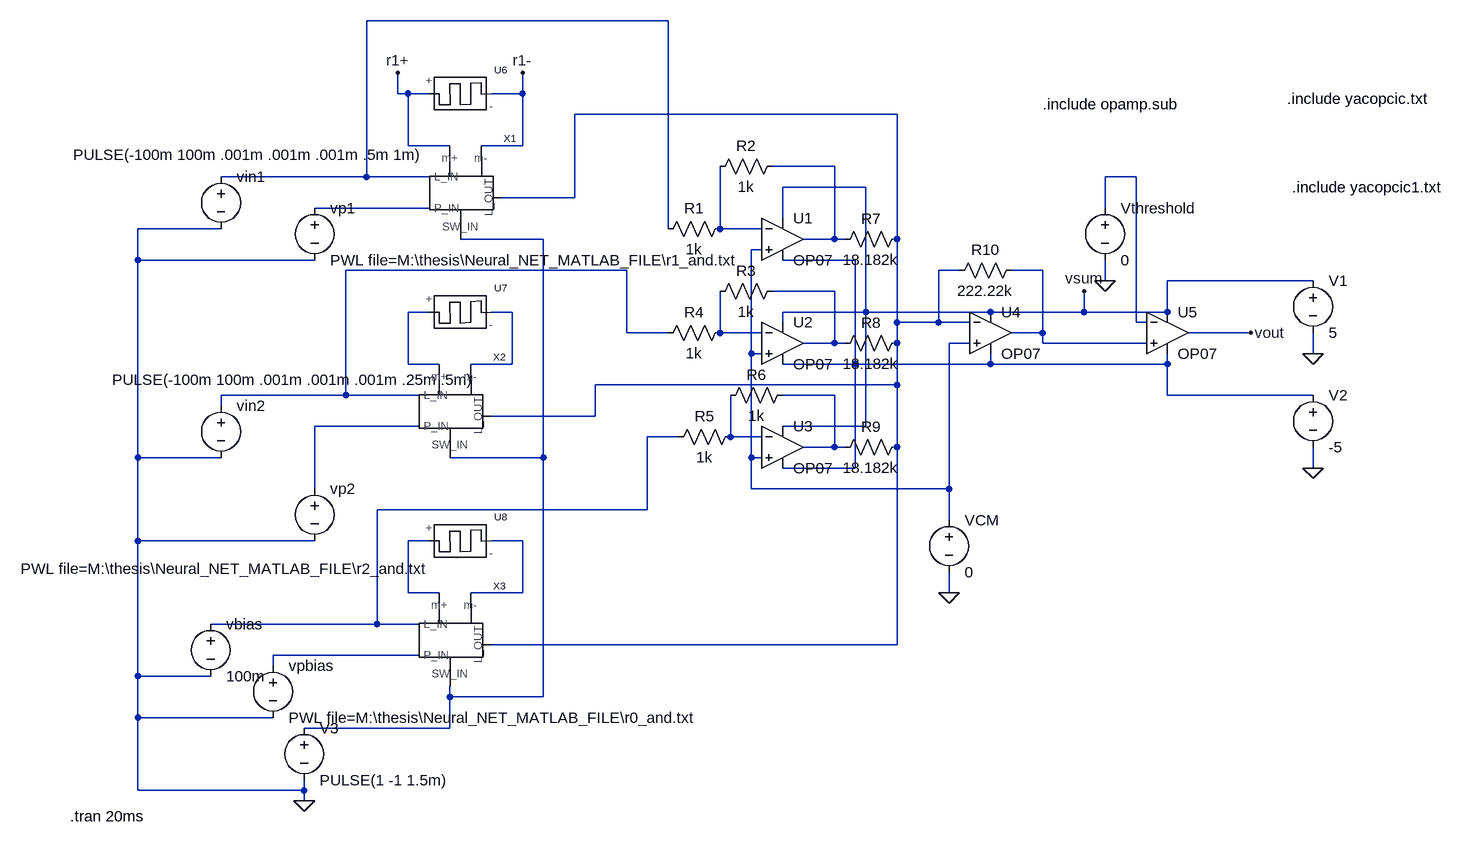
[diagram p0: schematic ADALINECHECK.asc]
ADALINECHECK.asc, the LTspice schematic file:
Version 4
SHEET 1 1164 968
WIRE -80 -272 -544 -272
WIRE -496 -160 -496 -192
WIRE -480 -160 -496 -160
WIRE -448 -160 -480 -160
WIRE -304 -160 -304 -192
WIRE -304 -160 -352 -160
WIRE 272 -128 -224 -128
WIRE -480 -80 -480 -160
WIRE -416 -80 -480 -80
WIRE -304 -80 -304 -160
WIRE -304 -80 -368 -80
WIRE 176 -48 80 -48
WIRE -544 -32 -544 -272
WIRE -544 -32 -768 -32
WIRE -448 -32 -544 -32
WIRE 640 -32 592 -32
WIRE 224 -16 96 -16
WIRE -224 0 -224 -128
WIRE -224 0 -336 0
WIRE -448 16 -624 16
WIRE 592 16 592 -32
WIRE 96 32 96 -16
WIRE -768 48 -896 48
WIRE -80 48 -80 -272
WIRE 0 48 0 -48
WIRE 64 48 0 48
WIRE -272 64 -400 64
WIRE 176 64 176 -48
WIRE 176 64 128 64
WIRE 192 64 176 64
WIRE 272 64 272 -128
WIRE 64 80 48 80
WIRE -896 96 -896 48
WIRE -624 96 -896 96
WIRE 208 96 96 96
WIRE -144 112 -576 112
WIRE 368 112 336 112
WIRE 496 112 448 112
WIRE 592 128 592 96
WIRE 912 128 688 128
WIRE 176 144 80 144
WIRE -448 176 -480 176
WIRE -320 176 -352 176
WIRE 224 176 224 -16
WIRE 224 176 96 176
WIRE 416 176 224 176
WIRE 560 176 560 144
WIRE 560 176 416 176
WIRE 688 176 688 128
WIRE 688 176 560 176
WIRE 96 192 96 176
WIRE 272 192 272 64
WIRE 336 192 336 112
WIRE 336 192 272 192
WIRE 384 192 336 192
WIRE 640 192 640 -32
WIRE 656 192 640 192
WIRE -144 208 -144 112
WIRE -80 208 -144 208
WIRE 0 208 0 144
WIRE 64 208 0 208
WIRE 496 208 496 112
WIRE 496 208 448 208
WIRE 816 208 720 208
WIRE 176 224 176 144
WIRE 176 224 128 224
WIRE 192 224 176 224
WIRE 272 224 272 192
WIRE 384 224 352 224
WIRE 496 224 496 208
WIRE 656 224 496 224
WIRE 48 240 48 80
WIRE 64 240 48 240
WIRE 912 240 912 208
WIRE -480 256 -480 176
WIRE -432 256 -480 256
WIRE -320 256 -320 176
WIRE -320 256 -384 256
WIRE 208 256 208 96
WIRE 208 256 96 256
WIRE 416 256 416 240
WIRE 416 256 208 256
WIRE 688 256 688 240
WIRE 688 256 416 256
WIRE 272 288 272 224
WIRE 272 288 -192 288
WIRE -576 304 -576 112
WIRE -576 304 -768 304
WIRE -464 304 -576 304
WIRE 176 304 96 304
WIRE 688 304 688 256
WIRE 912 304 688 304
WIRE -768 320 -768 304
WIRE -192 336 -192 288
WIRE -192 336 -352 336
WIRE -464 352 -624 352
WIRE 224 352 224 176
WIRE 224 352 96 352
WIRE -64 368 -112 368
WIRE 16 368 16 304
WIRE 64 368 16 368
WIRE 176 384 176 304
WIRE 176 384 128 384
WIRE 192 384 176 384
WIRE 272 384 272 288
WIRE -896 400 -896 96
WIRE -768 400 -896 400
WIRE -272 400 -272 64
WIRE -272 400 -416 400
WIRE 48 400 48 240
WIRE 64 400 48 400
WIRE 208 416 208 256
WIRE 208 416 96 416
WIRE 912 416 912 384
WIRE -624 448 -624 352
WIRE 48 448 48 400
WIRE 352 448 352 224
WIRE 352 448 48 448
WIRE -112 480 -112 368
WIRE -112 480 -528 480
WIRE 352 496 352 448
WIRE -896 528 -896 400
WIRE -624 528 -896 528
WIRE -448 528 -480 528
WIRE -304 528 -352 528
WIRE -480 608 -480 528
WIRE -432 608 -480 608
WIRE -304 608 -304 528
WIRE -304 608 -384 608
WIRE 352 608 352 576
WIRE -528 656 -528 480
WIRE -528 656 -784 656
WIRE -464 656 -528 656
WIRE 272 688 272 384
WIRE 272 688 -352 688
WIRE -464 704 -688 704
WIRE -688 720 -688 704
WIRE -896 736 -896 528
WIRE -784 736 -896 736
WIRE -416 768 -416 752
WIRE -272 768 -272 400
WIRE -272 768 -416 768
WIRE -896 800 -896 736
WIRE -688 800 -896 800
WIRE -416 816 -416 768
WIRE -416 816 -640 816
WIRE -896 912 -896 800
WIRE -640 912 -640 896
WIRE -640 912 -896 912
WIRE -640 928 -640 912
FLAG 912 416 0
FLAG 912 240 0
FLAG 352 608 0
FLAG -640 928 0
FLAG 816 208 vout
FLAG 560 144 vsum
FLAG 592 128 0
FLAG -496 -192 r1+
FLAG -304 -192 r1-
SYMBOL Opamps\\OP07 96 0 R0
SYMATTR InstName U1
SYMBOL Opamps\\OP07 96 160 R0
SYMATTR InstName U2
SYMBOL Opamps\\OP07 96 320 R0
SYMATTR InstName U3
SYMBOL Opamps\\OP07 416 144 R0
SYMATTR InstName U4
SYMBOL Opamps\\OP07 688 144 R0
SYMATTR InstName U5
SYMBOL res 16 32 R90
WINDOW 0 0 56 VBottom 2
WINDOW 3 32 56 VTop 2
SYMATTR InstName R1
SYMATTR Value 1k
SYMBOL res 96 -64 R90
WINDOW 0 0 56 VBottom 2
WINDOW 3 32 56 VTop 2
SYMATTR InstName R2
SYMATTR Value 1k
SYMBOL res 96 128 R90
WINDOW 0 0 56 VBottom 2
WINDOW 3 32 56 VTop 2
SYMATTR InstName R3
SYMATTR Value 1k
SYMBOL res 16 192 R90
WINDOW 0 0 56 VBottom 2
WINDOW 3 32 56 VTop 2
SYMATTR InstName R4
SYMATTR Value 1k
SYMBOL res 32 352 R90
WINDOW 0 0 56 VBottom 2
WINDOW 3 32 56 VTop 2
SYMATTR InstName R5
SYMATTR Value 1k
SYMBOL res 112 288 R90
WINDOW 0 0 56 VBottom 2
WINDOW 3 32 56 VTop 2
SYMATTR InstName R6
SYMATTR Value 1k
SYMBOL res 288 48 R90
WINDOW 0 0 56 VBottom 2
WINDOW 3 32 56 VTop 2
SYMATTR InstName R7
SYMATTR Value 18.182k
SYMBOL res 288 208 R90
WINDOW 0 0 56 VBottom 2
WINDOW 3 32 56 VTop 2
SYMATTR InstName R8
SYMATTR Value 18.182k
SYMBOL res 288 368 R90
WINDOW 0 0 56 VBottom 2
WINDOW 3 32 56 VTop 2
SYMATTR InstName R9
SYMATTR Value 18.182k
SYMBOL res 464 96 R90
WINDOW 0 0 56 VBottom 2
WINDOW 3 32 56 VTop 2
SYMATTR InstName R10
SYMATTR Value 222.22k
SYMBOL memristormodel -368 -160 R0
SYMATTR InstName U6
SYMATTR Value MEM_YAKOPCIC1
SYMATTR SpiceModel M1
SYMBOL memristormodel -368 176 R0
SYMATTR InstName U7
SYMATTR Value MEM_YAKOPCIC
SYMATTR SpiceModel M2
SYMBOL memristormodel -368 528 R0
SYMATTR InstName U8
SYMATTR Value MEM_YAKOPCIC
SYMATTR SpiceModel M0
SYMBOL voltage 912 112 R0
WINDOW 123 0 0 Left 2
WINDOW 39 0 0 Left 2
SYMATTR InstName V1
SYMATTR Value 5
SYMBOL voltage 912 288 R0
WINDOW 123 0 0 Left 2
WINDOW 39 0 0 Left 2
SYMATTR InstName V2
SYMATTR Value -5
SYMBOL voltage -640 800 R0
WINDOW 123 0 0 Left 2
WINDOW 39 0 0 Left 2
SYMATTR InstName V3
SYMATTR Value PULSE(1 -1 1.5m)
SYMBOL voltage -624 432 R0
WINDOW 123 0 0 Left 2
WINDOW 39 0 0 Left 2
WINDOW 3 -452 139 Left 2
SYMATTR InstName vp2
SYMATTR Value PWL file=M:\thesis\Neural_NET_MATLAB_FILE\r2_and.txt
SYMBOL voltage -768 304 R0
WINDOW 3 -167 -24 Left 2
WINDOW 123 0 0 Left 2
WINDOW 39 0 0 Left 2
SYMATTR Value PULSE(-100m 100m .001m .001m .001m .25m .5m)
SYMATTR InstName vin2
SYMBOL voltage -624 0 R0
WINDOW 123 0 0 Left 2
WINDOW 39 0 0 Left 2
SYMATTR InstName vp1
SYMATTR Value PWL file=M:\thesis\Neural_NET_MATLAB_FILE\r1_and.txt
SYMBOL voltage -768 -48 R0
WINDOW 3 -227 -18 Left 2
WINDOW 123 0 0 Left 2
WINDOW 39 0 0 Left 2
SYMATTR Value PULSE(-100m 100m .001m .001m .001m .5m 1m)
SYMATTR InstName vin1
SYMBOL voltage 352 480 R0
WINDOW 123 0 0 Left 2
WINDOW 39 0 0 Left 2
SYMATTR InstName VCM
SYMATTR Value 0
SYMBOL voltage -784 640 R0
WINDOW 123 0 0 Left 2
WINDOW 39 0 0 Left 2
SYMATTR InstName vbias
SYMATTR Value 100m
SYMBOL voltage -688 704 R0
WINDOW 123 0 0 Left 2
WINDOW 39 0 0 Left 2
SYMATTR InstName vpbias
SYMATTR Value PWL file=M:\thesis\Neural_NET_MATLAB_FILE\r0_and.txt
SYMBOL voltage 592 0 R0
WINDOW 123 0 0 Left 2
WINDOW 39 0 0 Left 2
SYMATTR InstName Vthreshold
SYMATTR Value 0
SYMBOL Switchboxsymbol -448 0 R0
SYMATTR InstName X1
SYMBOL Switchboxsymbol -464 336 R0
SYMATTR InstName X2
SYMBOL Switchboxsymbol -464 688 R0
SYMATTR InstName X3
TEXT 872 -152 Left 2 !.include yacopcic.txt
TEXT -1000 952 Left 2 !.tran 20ms
TEXT 496 -144 Left 2 !.include opamp.sub
TEXT 880 -16 Left 2 !.include yacopcic1.txt

The netlist it stands for:
* ADALINECHECK.asc
XU1 N008 N006 vsum N009 N003 LT1001  ; OP07, pins In+ In- V+ V- OUT
XU2 N008 N015 vsum N009 N012 LT1001  ; OP07, pins In+ In- V+ V- OUT
XU3 N008 N019 vsum N009 N016 LT1001  ; OP07, pins In+ In- V+ V- OUT
XU4 N008 N002 vsum N009 N011 LT1001  ; OP07, pins In+ In- V+ V- OUT
XU5 N011 N004 vsum N009 vout LT1001  ; OP07, pins In+ In- V+ V- OUT
R1 N006 N001 1k
R2 N003 N006 1k
R3 N012 N015 1k
R4 N015 N010 1k
R5 N019 N018 1k
R6 N016 N019 1k
R7 N002 N003 18.182k
R8 N002 N012 18.182k
R9 N002 N016 18.182k
R10 N011 N002 222.22k
XU6 r1+ r1- M1 MEM_YAKOPCIC1  ; pins + -
XU7 N013 N014 M2 MEM_YAKOPCIC  ; pins + -
XU8 N020 N021 M0 MEM_YAKOPCIC  ; pins + -
V1 vsum 0 5
V2 N009 0 -5
V3 N007 0 PULSE(1 -1 1.5m)
vp2 N017 0 PWL file=M:\thesis\Neural_NET_MATLAB_FILE\r2_and.txt
vin2 N010 0 PULSE(-100m 100m .001m .001m .001m .25m .5m)
vp1 N005 0 PWL file=M:\thesis\Neural_NET_MATLAB_FILE\r1_and.txt
vin1 N001 0 PULSE(-100m 100m .001m .001m .001m .5m 1m)
VCM N008 0 0
vbias N018 0 100m
vpbias N022 0 PWL file=M:\thesis\Neural_NET_MATLAB_FILE\r0_and.txt
Vthreshold N004 0 0
S§X1 N001 N005 N002 r1+ r1- N007
S§X2 N010 N017 N002 N013 N014 N007
S§X3 N018 N022 N002 N020 N021 N007
.include yacopcic.txt
.tran 20ms
.include opamp.sub
.include yacopcic1.txt
.lib LTC.lib
.backanno
.end